# EAGLE schematic main_mosfet (EAGLE 7.3.0)
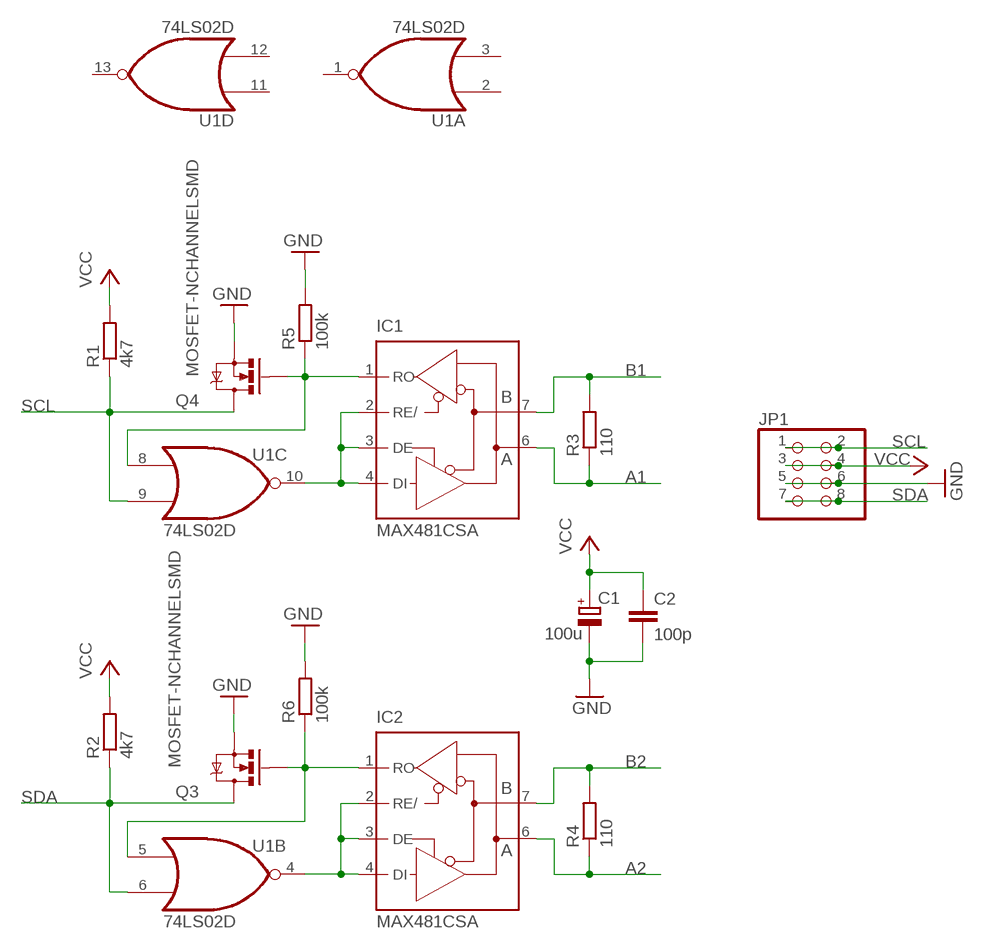
[diagram p0: schematic, sheet 1]

## Parts
C1  100u  CPOL-EUE2-4  [E2-4]
C2  100p  C-EU025-024X044  [C025-024X044]
IC1  MAX481CSA  [SO08]
IC2  MAX481CSA  [SO08]
JP1  PINHD-2X4  [2X04]
Q3  MOSFET-NCHANNELSMD  [SOT23-3]
Q4  MOSFET-NCHANNELSMD  [SOT23-3]
R1  4k7  R-EU_R0805  [R0805]
R2  4k7  R-EU_R0805  [R0805]
R3  110  R-EU_R0805  [R0805]
R4  110  R-EU_R0805  [R0805]
R5  100k  R-EU_R0805  [R0805]
R6  100k  R-EU_R0805  [R0805]
U1  74LS02D  [SO14]

## Nets
A1: IC1.6(A) R3.1
A2: IC2.6(A) R4.1
B1: IC1.7(B) R3.2
B2: IC2.7(B) R4.2
GND: C1.- C2.2 JP1.5 JP1.6 Q3.2(S) Q4.2(S) R5.2 R6.2
N$1: IC2.2(RE/) IC2.3(DE) IC2.4(DI) U1.4(B:O)
N$2: IC2.1(RO) Q3.1(G) R6.1 U1.5(B:I0)
N$6: IC1.2(RE/) IC1.3(DE) IC1.4(DI) U1.10(C:O)
N$7: IC1.1(RO) Q4.1(G) R5.1 U1.8(C:I0)
SCL: JP1.1 JP1.2 Q4.3(D) R1.1 U1.9(C:I1)
SDA: JP1.7 JP1.8 Q3.3(D) R2.1 U1.6(B:I1)
VCC: C1.+ C2.1 JP1.3 JP1.4 R1.2 R2.2
Unconnected: U1.1(A:O) U1.2(A:I0) U1.3(A:I1) U1.11(D:I0) U1.12(D:I1) U1.13(D:O)

## Power pins joined to a net without a drawn wire
GND: IC1.5(GND) IC2.5(GND) U1.7(P:GND)
VCC: IC1.8(VCC) IC2.8(VCC) U1.14(P:VCC)

## Library data of the parts
C1 = resistor:CPOL-EU: POLARIZED CAPACITOR, European symbol
C2 = resistor:C-EU: CAPACITOR, European symbol
IC1 IC2 = maxim:MAX481CSA: RS485 TRANSEIVER
JP1 = pinhead:PINHD-2X4: PIN HEADER
Q3 Q4 = fets:MOSFET-NCHANNEL: Generic NMOS footprint
R1-R6 = resistor:R-EU_: RESISTOR, European symbol
U1 = 74xx-us:74*02: Quad 2-input NOR gate